# Altium schematic sheet MCU.SchDoc
size A; SheetNumber: 7
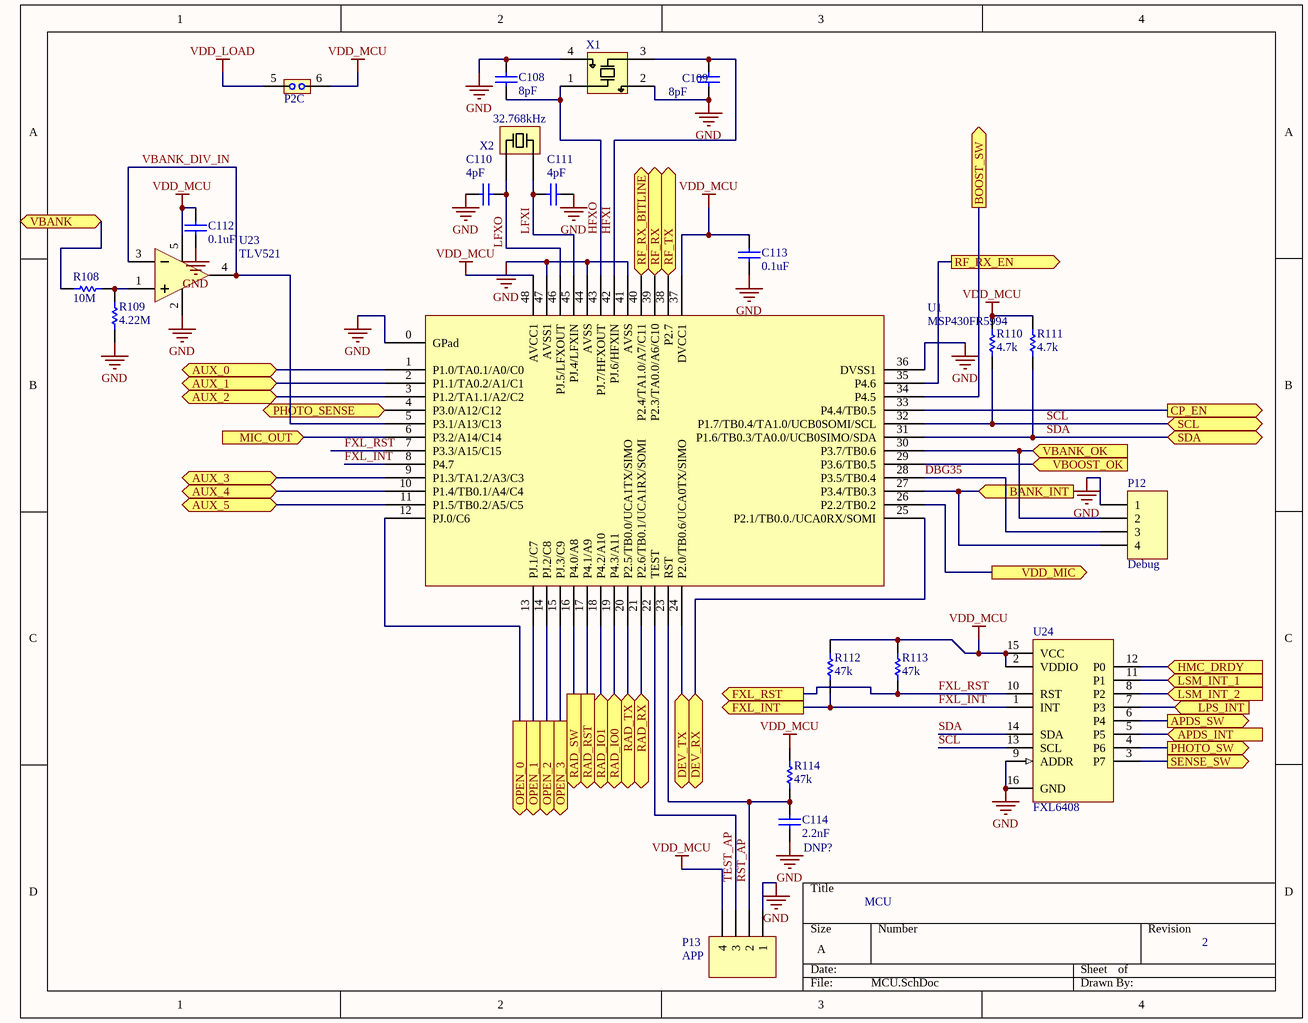
[diagram p0: MCU.SchDoc]

## Parts
C108  value 8pF  [0402]  (hidden comment: Cap)
C109  value 8pF  [0402]  (hidden comment: Cap)
C110  value 4pF  [0402]  (hidden comment: Cap)
C111  value 4pF  [0402]  (hidden comment: Cap)
C112  value 0.1uF  [0603]  (hidden comment: Cap)
C113  value 0.1uF  [0603]  (hidden comment: Cap)
C114  value 2.2nF  Note: DNP?  [0603]  (hidden comment: Cap)
P2  JMPHDR_8  [MHDR2X8]  (value not drawn)  (part C of 8)
P12  Debug  [MHDR1X4]
P13  APP  [MHDR1X4]
R108  value 10M  [0603]  (hidden comment: Res)
R109  value 4.22M  [0603]  (hidden comment: Res)
R110  value 4.7k  [0603]  (hidden comment: Res)
R111  value 4.7k  [0603]  (hidden comment: Res)
R112  value 47k  [0603]  (hidden comment: Res)
R113  value 47k  [0603]  (hidden comment: Res)
R114  value 47k  [0603]  (hidden comment: Res)
U1  MSP430FR5994  [48-QFN - Round Pin 1]
U23  TLV521  [SC70-5]
U24  FXL6408  [16-UMLP]
X1  XTAL 4pin  [XTAL - 4Pin [2.5mm x 2.0mm]]  (value not drawn)
X2  value 32.768kHz  [XTAL - 2Pin [3.2mm x 1.5mm]]  (hidden comment: XTAL)

## Ports
APDS_INT (in), APDS_SW (out), AUX_0, AUX_1, AUX_2, AUX_3, AUX_4, AUX_5, BANK_INT (in), BOOST_SW (out), CP_EN (out), DEV_RX, DEV_TX, FXL_INT (out), FXL_RST (out), HMC_DRDY (in), LPS_INT (in), LSM_INT_1 (in), LSM_INT_2 (in), MIC_OUT (in), OPEN_0 (out), OPEN_1 (out), OPEN_2 (out), OPEN_3 (out), PHOTO_SENSE (in), PHOTO_SW (out), RAD_IO0 (bidir), RAD_IO1 (bidir), RAD_RST (out), RAD_RX (bidir), RAD_SW (out), RAD_TX (bidir), RF_RX (in), RF_RX_BITLINE (in), RF_RX_EN (out), RF_TX (out), SCL (bidir), SDA (bidir), SENSE_SW (out), VBANK, VBANK_OK (in), VBOOST_OK (in), VDD_MIC (out)

## Nets
GND: C108.2 C109.1 C110.1 C111.2 C112.2 C113.2 C114.2 P12.1 P13.1 R109.2 U1.0(GPad) U1.36(DVSS1) U1.41(AVSS) U1.44(AVSS) U1.47(AVSS1) U23.2(IN-) U24.9(ADDR) U24.16(GND) X1.2(Gnd) X1.4(Gnd)
VDD_LOAD: P2.5
VDD_MCU: C112.1 C113.1 P2.6 P13.4 R110.2 R111.2 R112.2 R113.2 R114.2 U1.37(DVCC1) U1.48(AVCC1) U23.5(OS_NUL) U24.2(VDDIO) U24.15(VCC)
APDS_INT: U24.5(P5) ; port APDS_INT
APDS_SW: U24.6(P4) ; port APDS_SW
AUX_0: U1.1(P1.0/TA0.1/A0/C0) ; port AUX_0
AUX_1: U1.2(P1.1/TA0.2/A1/C1) ; port AUX_1
AUX_2: U1.3(P1.2/TA1.1/A2/C2) ; port AUX_2
AUX_3: U1.9(P1.3/TA1.2/A3/C3) ; port AUX_3
AUX_4: U1.10(P1.4/TB0.1/A4/C4) ; port AUX_4
AUX_5: U1.11(P1.5/TB0.2/A5/C5) ; port AUX_5
BANK_INT: P12.4 U1.27(P3.4/TB0.3) ; port BANK_INT
BOOST_SW: U1.34(P4.5) ; port BOOST_SW
CP_EN: U1.33(P4.4/TB0.5) ; port CP_EN
DBG35: P12.3 U1.28(P3.5/TB0.4)
DEV_RX: U1.25(P2.1/TB0.0./UCA0RX/SOMI) ; port DEV_RX
DEV_TX: U1.24(P2.0/TB0.6/UCA0TX/SIMO) ; port DEV_TX
FXL_INT: R112.1 U1.8(P4.7) U24.1(INT) ; port FXL_INT
FXL_RST: R113.1 U1.7(P3.3/A15/C15) U24.10(RST) ; port FXL_RST
HFXI: C109.2 U1.42(PJ.6/HFXIN) X1.3(XOUT)
HFXO: C108.1 U1.43(PJ.7/HFXOUT) X1.1(XIN)
HMC_DRDY: U24.12(P0) ; port HMC_DRDY
LFXI: C111.1 U1.45(PJ.4/LFXIN) X2.1
LFXO: C110.2 U1.46(PJ.5/LFXOUT) X2.2
LPS_INT: U24.7(P3) ; port LPS_INT
LSM_INT_1: U24.11(P1) ; port LSM_INT_1
LSM_INT_2: U24.8(P2) ; port LSM_INT_2
MIC_OUT: U1.6(P3.2/A14/C14) ; port MIC_OUT
OPEN_0: U1.12(PJ.0/C6) ; port OPEN_0
OPEN_1: U1.13(PJ.1/C7) ; port OPEN_1
OPEN_2: U1.14(PJ.2/C8) ; port OPEN_2
OPEN_3: U1.15(PJ.3/C9) ; port OPEN_3
PHOTO_SENSE: U1.4(P3.0/A12/C12) ; port PHOTO_SENSE
PHOTO_SW: U24.4(P6) ; port PHOTO_SW
RAD_IO0: U1.19(P4.3/A11) ; port RAD_IO0
RAD_IO1: U1.18(P4.2/A10) ; port RAD_IO1
RAD_RST: U1.17(P4.1/A9) ; port RAD_RST
RAD_RX: U1.21(P2.6/TB0.1/UCA1RX/SOMI) ; port RAD_RX
RAD_SW: U1.16(P4.0/A8) ; port RAD_SW
RAD_TX: U1.20(P2.5/TB0.0/UCA1TX/SIMO) ; port RAD_TX
RF_RX: U1.39(P2.3/TA0.0/A6/C10) ; port RF_RX
RF_RX_BITLINE: U1.40(P2.4/TA1.0/A7/C11) ; port RF_RX_BITLINE
RF_RX_EN: U1.35(P4.6) ; port RF_RX_EN
RF_TX: U1.38(P2.7) ; port RF_TX
RST_AP: C114.1 P13.2 R114.1 U1.23(RST)
SCL: R110.1 U1.32(P1.7/TB0.4/TA1.0/UCB0SOMI/SCL) U24.13(SCL) ; port SCL
SDA: R111.1 U1.31(P1.6/TB0.3/TA0.0/UCB0SIMO/SDA) U24.14(SDA) ; port SDA
SENSE_SW: U24.3(P7) ; port SENSE_SW
TEST_AP: P13.3 U1.22(TEST)
VBANK: R108.1 ; port VBANK
VBANK_DIV_IN: U1.5(P3.1/A13/C13) U23.3(IN+) U23.4(TAB)
VBANK_OK: P12.2 U1.30(P3.7/TB0.6) ; port VBANK_OK
VBOOST_OK: U1.29(P3.6/TB0.5) ; port VBOOST_OK
VDD_MIC: U1.26(P2.2/TB0.2) ; port VDD_MIC
NetR108_2: R108.2 R109.1 U23.1(OS_NUL)

## Notes on the sheet
- MCU
- 2

## Library data of the parts
C108 C109 = Cap: Ceramic Capacitor (Surface Mount); Manufacturer: Murata Electronics North America; Manufacturer Part Number: GRM1555C1H8R0DA01D; Digi-Key Part Number: *; Note: *; Rating: *; Distributor Part Number: 490-5867-1-ND; Distributor: Digi-Key
C110 C111 = Cap: Ceramic Capacitor (Surface Mount); Manufacturer: Murata Electronics North America; Manufacturer Part Number: GRM1555C1H4R0CA01D; Digi-Key Part Number: *; Note: *; Rating: *; Distributor Part Number: 490-5873-1-ND; Distributor: Digi-Key
C112 C113 = Cap: Ceramic Capacitor (Surface Mount); Manufacturer: Murata Electronics North America; Manufacturer Part Number: GRM188R71C104KA01D; Note: *; Rating: *; Distributor Part Number: 490-1532-1-ND; Distributor: Digi-Key
C114 = Cap: Ceramic Capacitor (Surface Mount); Manufacturer: Murata Electronics North America; Manufacturer Part Number: GRM1885C1H222JA01D; Rating: *; Distributor Part Number: 490-1459-1-ND; Distributor: Digi-Key
P12 P13 = MHDR1X4: Header, 4-Pin; Manufacturer: Harwin Inc.; Manufacturer Part Number: M52-5000445; LatestRevisionDate: 17-Jul-2002; LatestRevisionNote: Re-released for DXP Platform.; Publisher: Altium Limited; Digi-Key Part Number: 952-3358-ND; Distributor: Mouser; Distributor Part Number: 855-M52-5000445; Mouser Part Number: 855-M52-5000445
R108 = Res: Chip Resistor (Surface Mount); Manufacturer: Yageo; Manufacturer Part Number: RC0603JR-0710ML; Rating: *; Note: *; Distributor: Digi-Key; Distributor Part Number: 311-10MGRCT-ND
R109 = Res: Chip Resistor (Surface Mount); Manufacturer: Vishay Dale; Manufacturer Part Number: CRCW06034M22FKEA; Rating: *; Note: *; Distributor: Digi-Key; Distributor Part Number: 541-4.22MHCT-ND
R110 R111 = Res: Chip Resistor (Surface Mount); Manufacturer: Yageo; Manufacturer Part Number: RC0402JR-074K7L; Rating: *; Note: *; Distributor: Digi-Key; Distributor Part Number: 311-4.7KJRCT-ND
R112-R114 = Res: Chip Resistor (Surface Mount); Manufacturer: Yageo; Manufacturer Part Number: RT0603DRD0747KL; Rating: *; Note: *; Distributor: Digi-Key; Distributor Part Number: 311-47KDCT-ND
U1 = MSP430FR5994 48-pin: MSP430 - 48LQFP or 48QFN; Manufacturer: Texas Instruments; Manufacturer Part Number: MSP430FR5994IRGZR; Digi-Key Part Number: 296-45416-1-ND; Rating: *; Value: *; Distributor: Mouser; Distributor Part Number: 595-P430FR5994IRGZR; Note: *; Mouser Part Number: 595-P430FR5994IRGZR
U23 = OPA333, 2333: Low power opamp; pin to pad: 1>3 3>4 4>1; Manufacturer: Texas Instruments; Manufacturer Part Number: TLV521DCKR; Digi-Key Part Number: 296-47441-1-ND; Distributor: Mouser; Distributor Part Number: 595-TLV521DCKR; Note: *; Rating: *; Value: *; Mouser Part Number: 595-TLV521DCKR
U24 = FXL6408: Manufacturer: ON Semiconductor / Fairchild; Manufacturer Part Number: FXL6408UMX; Name: FXL6408; Digi-Key Part Number: FXL6408UMXCT-ND; Distributor: Mouser; Distributor Part Number: 512-FXL6408UMX; Mouser Part Number: 512-FXL6408UMX
X1 = XTAL 4-pins: Crystal - 4-Pin Surface Mount; Manufacturer Part Number: ECS-240-8-36CKM-TR; Manufacturer: ECS Inc.; Rating: 8pF; Value: 24Mhz; Digi-Key Part Number: XC1557CT-ND; Distributor: Mouser; Distributor Part Number: 520-ECS-240-8-36CKM; Mouser Part Number: 520-ECS-240-8-36CKM
X2 = XTAL 2-pins: Crystal - 2-Pin Surface Mount; Manufacturer: ECS Inc.; Manufacturer Part Number: ECS-.327-6-34QCS-TR; Rating: 6pF; Digi-Key Part Number: XC2162CT-ND; Distributor: Mouser; Distributor Part Number: 520-.327-6-34QCST; Mouser Part Number: 520-.327-6-34QCST